# Altium schematic sheet SH2 - RS-485.SchDoc: RS-485 Transceiver
size B; CheckedBy: Wolfgang Windholtz; Engineer: Sahil Kale; Revision: 1.0; SheetNumber: 2; SheetTotal: 7
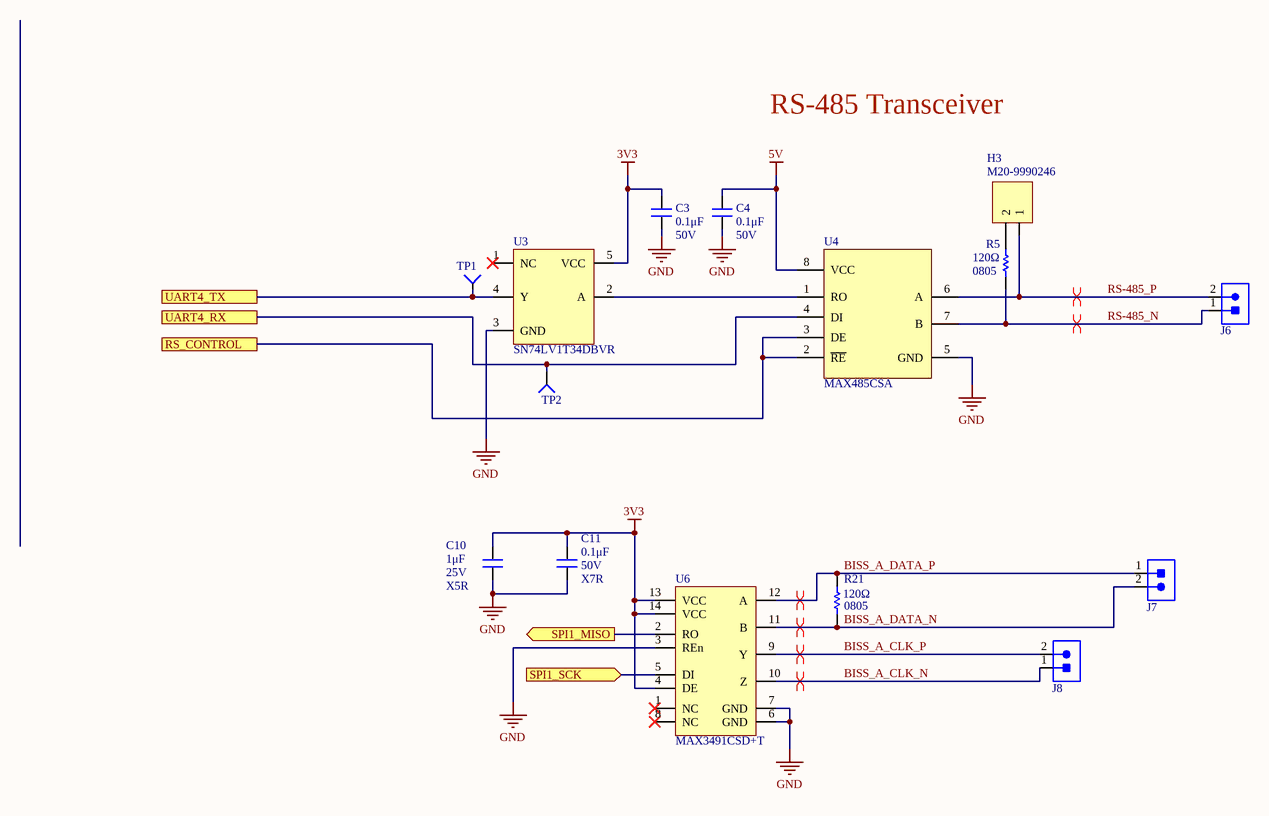
[diagram p0: SH2 - RS-485.SchDoc]

## Parts
C3  value 0.1μF  Voltage Rating: 50V  [CAP2012]  (hidden comment: CAP_0.1uF_50V_0805)
C4  value 0.1μF  Voltage Rating: 50V  [CAP2012]  (hidden comment: CAP_0.1uF_50V_0805)
C10  value 1μF  Dielectric: X5R  Voltage Rating: 25V  [CAP0603]  (hidden comment: CAP_1uF_25V_0603)
C11  value 0.1μF  Dielectric: X7R  Voltage Rating: 50V  [CAP0603]  (hidden comment: CAP_0.1uF_50V_0603)
H3  Manufacturer Part Number 1: M20-9990246  [HDR1X2]  (hidden comment: JUMPER)
J6  CON_2POS_SCREW_TERM  [1935161]  (value not drawn)
J7  CON_2POS_SCREW_TERM  [1935161]  (value not drawn)
J8  CON_2POS_SCREW_TERM  [1935161]  (value not drawn)
R5  value 120Ω  Package/Footprint: 0805  [RESC0805]  (hidden comment: RES_120Ω_0805_1%)
R21  value 120Ω  Package/Footprint: 0805  [RESC0805]  (hidden comment: RES_120Ω_0805_1%)
TP1  TESTPOINT_1MM_CIRCLE  [TESTPOINT_CIRCLE_1MM]  (value not drawn)  (no BOM)
TP2  TESTPOINT_1MM_CIRCLE  [TESTPOINT_CIRCLE_1MM]  (value not drawn)  (no BOM)
U3  IC_BUFFER  [SN74LV1T34DBVR]  (value not drawn)
U4  MAX485CSA  [SOIC127P600X175-8N]
U6  MAX3491  [MAX3491CSD+T]  (value not drawn)

## Ports
RS_CONTROL, SPI1_MISO (out), SPI1_SCK (in), UART4_RX, UART4_TX

## Nets
3V3: C3.1 C10.2 C11.2 U3.5(VCC) U6.4(DE) U6.13(VCC) U6.14(VCC)
5V: C4.1 U4.8(VCC)
GND: C3.2 C4.2 C10.1 C11.1 U3.3(GND) U4.5(GND) U6.3(REn) U6.6(GND) U6.7(GND)
BISS_A_CLK_N: J8.1 U6.10(Z)
BISS_A_CLK_P: J8.2 U6.9(Y)
BISS_A_DATA_N: J7.2 R21.1 U6.11(B)
BISS_A_DATA_P: J7.1 R21.2 U6.12(A)
RS-485_N: J6.1 R5.1 U4.7(B)
RS-485_P: H3.1 J6.2 U4.6(A)
RS_CONTROL: U4.2(~{RE}) U4.3(DE) ; port RS_CONTROL
SPI1_MISO: U6.2(RO) ; port SPI1_MISO
SPI1_SCK: U6.5(DI) ; port SPI1_SCK
UART4_RX: TP2.1(=value) U4.4(DI) ; port UART4_RX
UART4_TX: TP1.1(=value) U3.4(Y) ; port UART4_TX
NetH3_2: H3.2 R5.2
NetU3_2: U3.2(A) U4.1(RO)

Not connected (* = marked no-connect by the designer): U3 1(NC)*; U6 1(NC)* 8(NC)*

## Layout directives
differential pair: BISS_A_CLK_N, BISS_A_CLK_P, BISS_A_DATA_N, BISS_A_DATA_P, RS-485_N, RS-485_P

## Notes on the sheet
- RS-485 Transceiver
- Title:
- Project:
- Date:
- Rev:
- Checker:
- Engineer:
- Sheet:
- of

## Library data of the parts
C3 C4 = CAP_0.1uF_50V_0805: CAP CER 0.1UF 50V X7R 0805; Manufacturer Part Number 1: GCM21BR71H104KA37K; Manufacturer 1: Murata Electronics; Package/Footprint: 0805; Supplier Part Number 1: 490-8049-1-ND; Supplier 1: Digi-Key; Dielectric: X7R; Mounting Type: SMD; LCSC Part #: C49678
C10 = CAP_1uF_25V_0603: CAP CER 1UF 25V X5R 0603; Manufacturer 1: Samsung; Manufacturer Part Number 1: CL10A105KA8NNNC; Package/Footprint: 0603; Supplier 1: Digi-Key; Supplier Part Number 1: 1276-1102-1-ND; Mounting Type: SMD
C11 = CAP_0.1uF_50V_0603: CAP CER 0.1UF 50V X7R 0603; Manufacturer Part Number 1: CC0603KRX7R9BB104; Manufacturer 1: Yageo; Package/Footprint: 0603; Supplier Part Number 1: 311-1344-1-ND; Supplier 1: Digi-Key; Mounting Type: SMD
H3 = JUMPER: HEADER 2X1; Manufacturer 1: Harwin Inc.; Package/Footprint: TH; Supplier 1: Digi-Key; Supplier Part Number 1: 952-2262-ND; Mounting Type: TH
J6-J8 = CON_2POS_SCREW_TERM: TERM BLK 2POS SIDE ENTRY 5MM; Manufacturer 1: Phoenix Contact; Package/Footprint: SMD; Supplier 1: Digi-Key; Mounting Type: TH; Supplier Part Number 1: 277-1667-ND; Manufacturer Part Number 1: 1935161
R5 R21 = RES_120Ω_0805_1%: RES 120 OHM 1% 1/8W 0805; Manufacturer 1: Vishay; Manufacturer Part Number 1: CRCW0805120RFKEA; Supplier Part Number 1: 541-120CCT-ND; Supplier 1: Digi-Key; Mounting Type: SMD; LCSC Part #: C17437
TP1 TP2 = TESTPOINT_1MM_CIRCLE: TESTPOINT 1MM CIRCLE
U3 = IC_BUFFER: IC BUF NON-INVERT 5.5V SOT23-5; Manufacturer 1: Texas Instruments; Package/Footprint: SOT-23-5; Supplier 1: Digi-Key; Supplier Part Number 1: 296-37176-1-ND; Manufacturer Part Number 1: SN74LV1T34DBVR; Mounting Type: SMD; LCSC Part #: C100024
U4 = MAX485CSA: IC RS485 TRANSCEIVER HALF 1/1 8SOIC; Manufacturer 1: Maxim Integrated; Manufacturer Part Number 1: MAX485CSA+T; Protocol: RS422, RS485; Data Rate: 2.5Mbps; Supply Voltage: 4.75V - 5.25V; Package/Footprint: 8-SOIC; Supplier 1: Digi-Key; Supplier Part Number 1: MAX485CSA+TCT-ND; Mounting Type: SMD; LCSC Part #: C9945
U6 = MAX3491: IC RS485 TRANSCEIVER FULL 1/1 14SOIC; Manufacturer 1: Maxim; Package/Footprint: 14-SOIC; Supplier 1: Digi-Key; Supplier Part Number 1: MAX3491CSD+CT-ND; Manufacturer Part Number 1: MAX3491CSD+T; Mounting Type: SMD